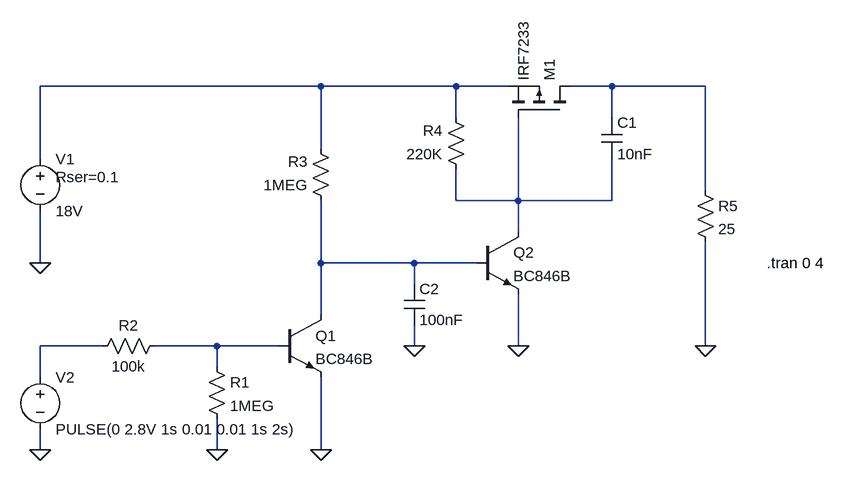
[diagram p0: schematic pwr_ctrl.asc]
pwr_ctrl.asc, the LTspice schematic file:
Version 4
SHEET 1 956 680
WIRE 80 -160 -352 -160
WIRE 288 -160 80 -160
WIRE 368 -160 288 -160
WIRE 528 -160 464 -160
WIRE 672 -160 528 -160
WIRE 288 -112 288 -160
WIRE 528 -112 528 -160
WIRE 80 -64 80 -160
WIRE -352 -48 -352 -160
WIRE 672 0 672 -160
WIRE 288 16 288 -32
WIRE 384 16 384 -112
WIRE 384 16 288 16
WIRE 528 16 528 -48
WIRE 528 16 384 16
WIRE 384 64 384 16
WIRE -352 112 -352 32
WIRE 80 112 80 16
WIRE 224 112 80 112
WIRE 320 112 224 112
WIRE 224 144 224 112
WIRE 80 192 80 112
WIRE -256 240 -352 240
WIRE -80 240 -176 240
WIRE 16 240 -80 240
WIRE 224 240 224 208
WIRE 384 240 384 160
WIRE 672 240 672 80
WIRE -80 272 -80 240
WIRE -352 288 -352 240
WIRE -352 400 -352 368
WIRE -80 400 -80 352
WIRE 80 400 80 288
FLAG 672 240 0
FLAG 384 240 0
FLAG 80 400 0
FLAG -352 112 0
FLAG -352 400 0
FLAG -80 400 0
FLAG 224 240 0
SYMBOL npn 16 192 R0
SYMATTR InstName Q1
SYMATTR Value BC846B
SYMBOL npn 320 64 R0
SYMATTR InstName Q2
SYMATTR Value BC846B
SYMBOL res -160 224 R90
WINDOW 0 0 56 VBottom 2
WINDOW 3 32 56 VTop 2
SYMATTR InstName R2
SYMATTR Value 100k
SYMBOL res 96 32 R180
WINDOW 0 36 76 Left 2
WINDOW 3 36 40 Left 2
SYMATTR InstName R3
SYMATTR Value 1MEG
SYMBOL res 304 -16 R180
WINDOW 0 36 76 Left 2
WINDOW 3 36 40 Left 2
SYMATTR InstName R4
SYMATTR Value 220K
SYMBOL pmos 464 -112 M270
SYMATTR InstName M1
SYMATTR Value IRF7233
SYMBOL res 656 -16 R0
SYMATTR InstName R5
SYMATTR Value 25
SYMBOL voltage -352 -64 R0
WINDOW 123 0 0 Left 2
WINDOW 39 24 44 Left 2
SYMATTR InstName V1
SYMATTR Value 18V
SYMATTR SpiceLine Rser=0.1
SYMBOL voltage -352 272 R0
WINDOW 123 0 0 Left 2
WINDOW 39 0 0 Left 2
SYMATTR InstName V2
SYMATTR Value PULSE(0 2.8V 1s 0.01 0.01 1s 2s)
SYMBOL cap 512 -112 R0
SYMATTR InstName C1
SYMATTR Value 10nF
SYMBOL res -96 256 R0
SYMATTR InstName R1
SYMATTR Value 1MEG
SYMBOL cap 208 144 R0
SYMATTR InstName C2
SYMATTR Value 100nF
TEXT 766 112 Left 2 !.tran 0 4

The netlist it stands for:
* pwr_ctrl.asc
Q1 N004 N006 0 0 BC846B
Q2 N003 N004 0 0 BC846B
R2 N006 N005 100k
R3 N004 N001 1MEG
R4 N003 N001 220K
M1 N002 N003 N001 N001 IRF7233
R5 N002 0 25
V1 N001 0 18V Rser=0.1
V2 N005 0 PULSE(0 2.8V 1s 0.01 0.01 1s 2s)
C1 N002 N003 10nF
R1 N006 0 1MEG
C2 N004 0 100nF
.model NPN NPN
.model PNP PNP
.lib standard.bjt
.model NMOS NMOS
.model PMOS PMOS
.lib standard.mos
.tran 0 4
.backanno
.end